# EasyEDA schematic Schematic.json
TITLE: Sheet_1; REV: 1.0; Date: 2025-10-23; Sheet: 1/1; Drawn By: leodu; Company: Your Company
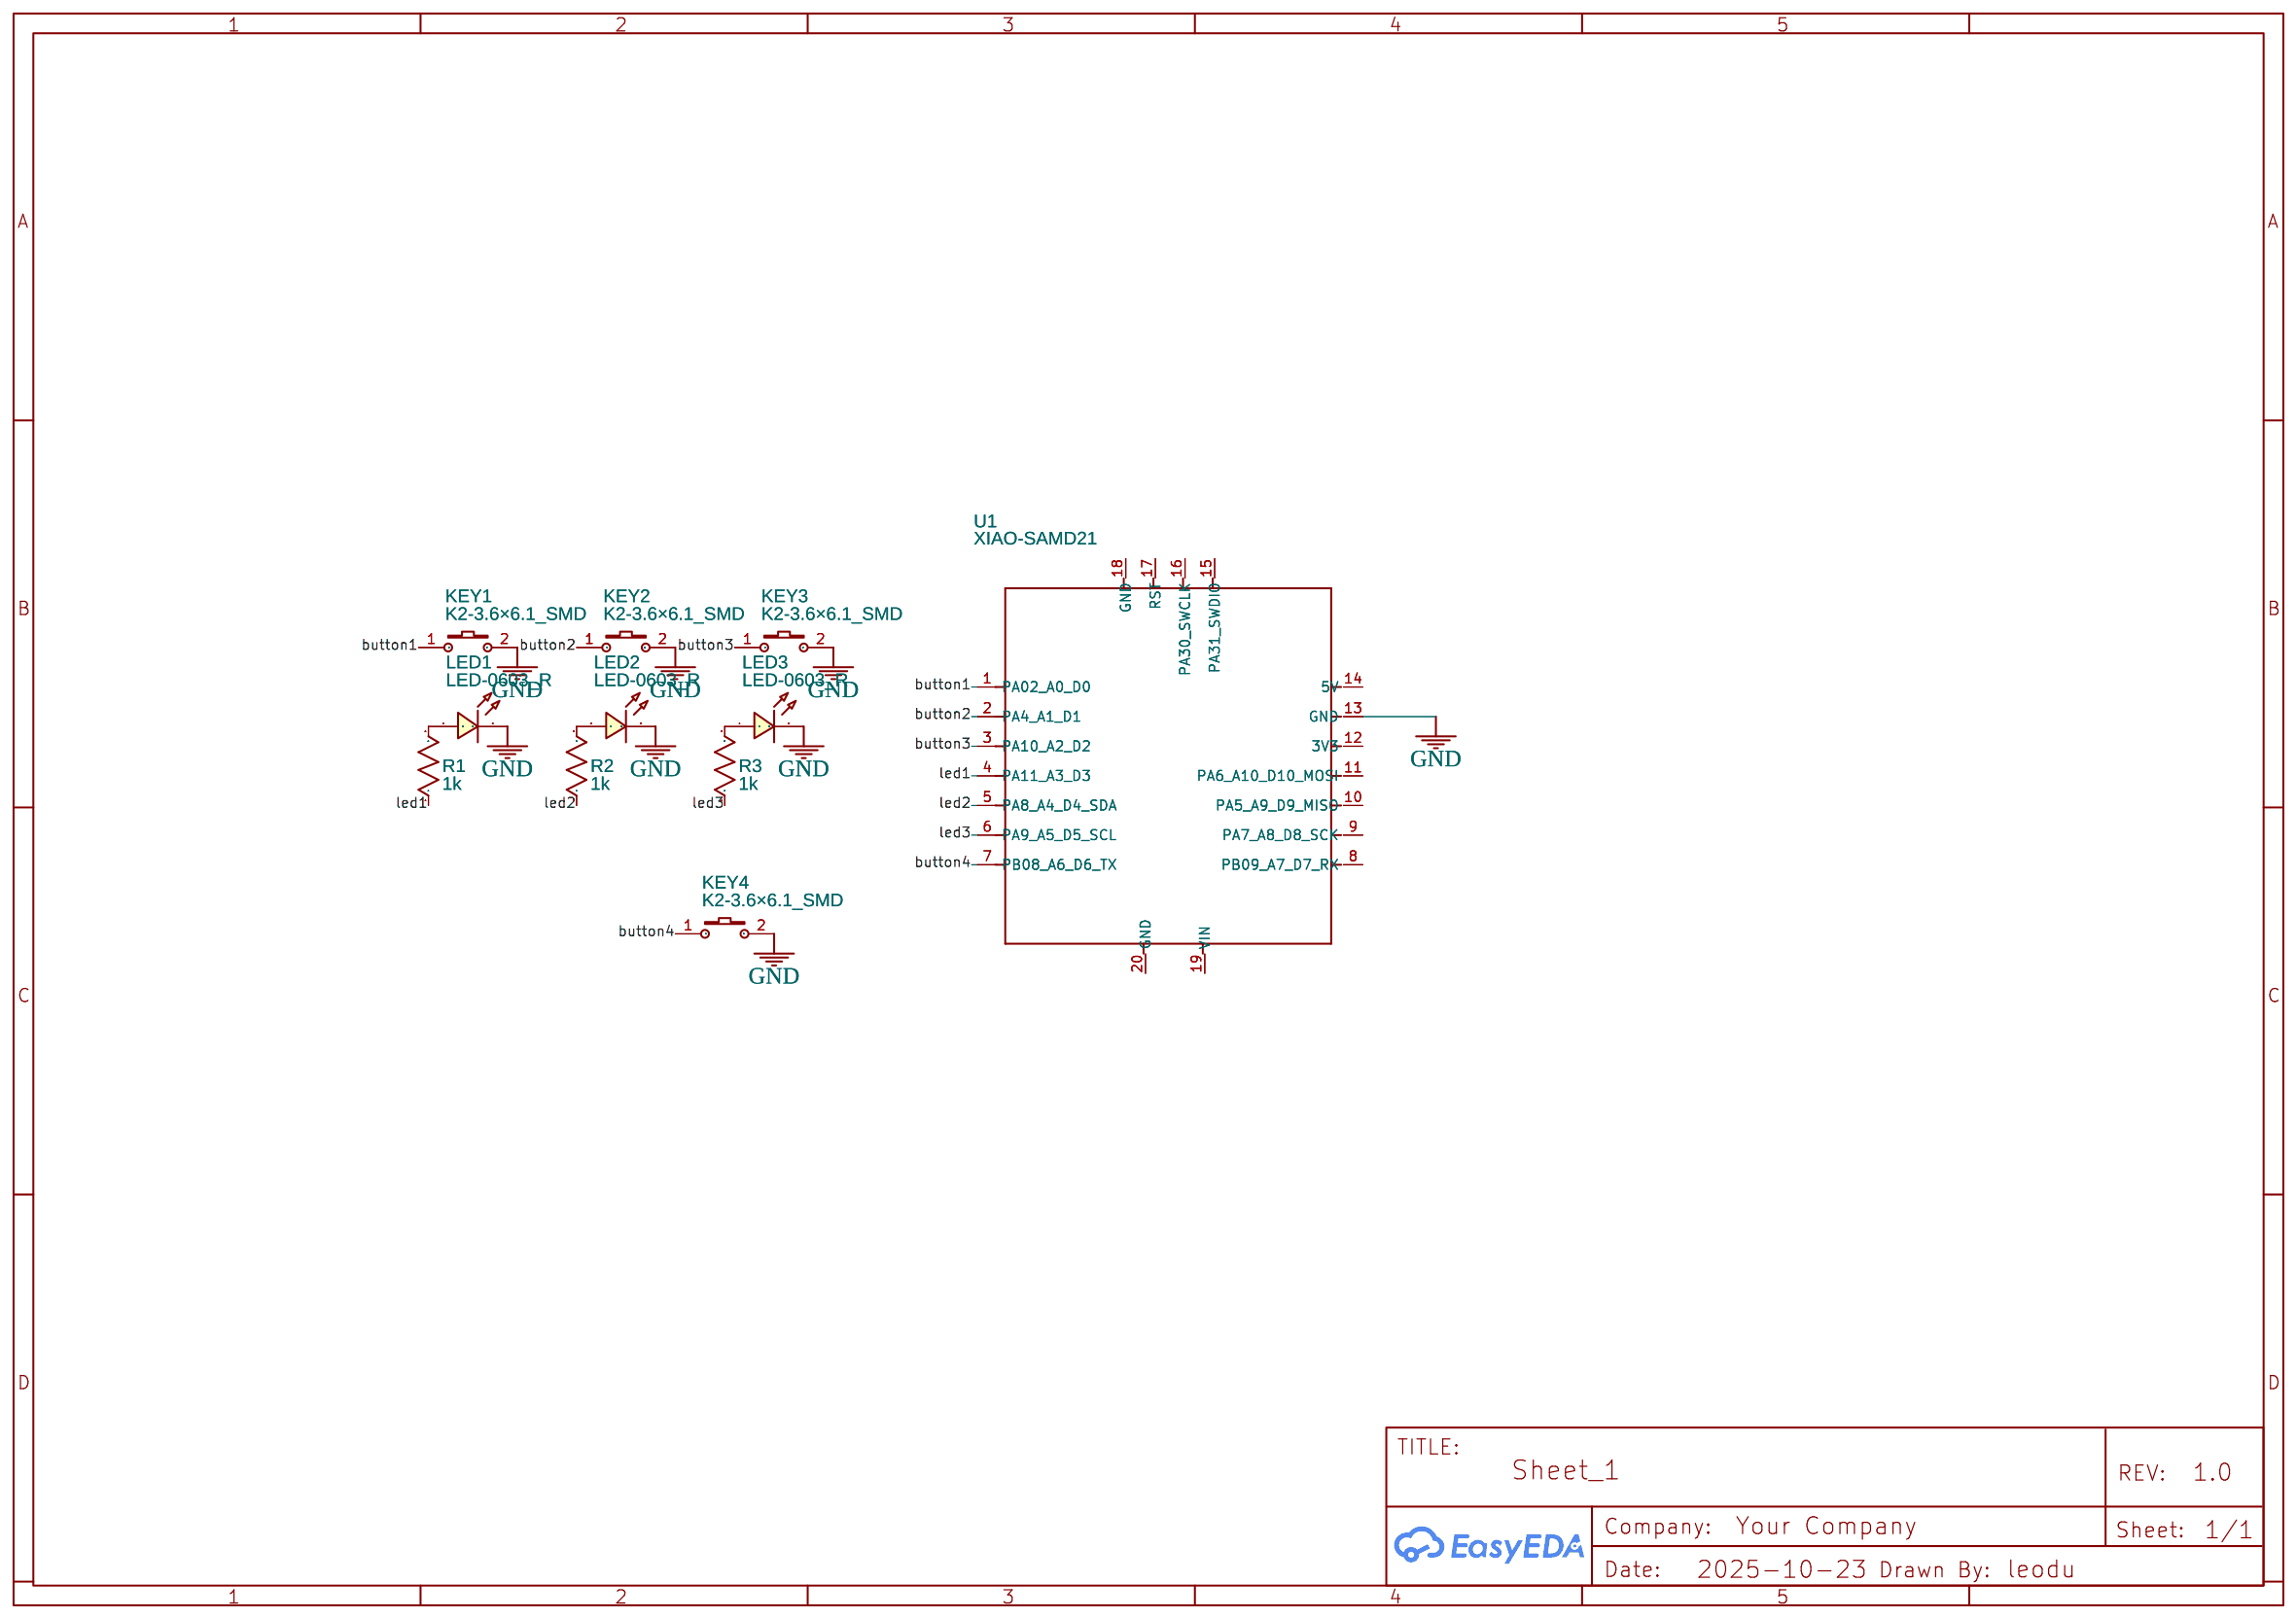
[diagram p0: schematic sheet]

## Parts
KEY1  K2-3.6×6.1_SMD  [KEY-SMD_2P-L6.2-W3.6-LS8.0]
KEY2  K2-3.6×6.1_SMD  [KEY-SMD_2P-L6.2-W3.6-LS8.0]
KEY3  K2-3.6×6.1_SMD  [KEY-SMD_2P-L6.2-W3.6-LS8.0]
KEY4  K2-3.6×6.1_SMD  [KEY-SMD_2P-L6.2-W3.6-LS8.0]
LED1  LED-0603_R  [LED0603_RED]
LED2  LED-0603_R  [LED0603_RED]
LED3  LED-0603_R  [LED0603_RED]
R1  1k  [R0603]
R2  1k  [R0603]
R3  1k  [R0603]
U1  XIAO-SAMD21  [XIAO-SAMD21/RP2040-MODULE14P-2.54-21X17.8MM]

## Library data of the parts
KEY1-KEY4 = K2-3.6×6.1_SMD: Supplier Part: C118141; Supplier: LCSC; Manufacturer Part: K2-1107ST-A4SW-06; Contributor: LCEDA_Lib; 制造商: 韩国韩荣
LED1-LED3 = LED-0603_R: Manufacturer: EVERLIGHT(台湾亿光); Manufacturer Part: 19-217/R6C-AL1M2VY/3T; Supplier Part: C72044; Supplier: LCSC; Contributor: LCEDA_01
R1-R3 = R_0603_US: Contributor: LCEDA_Lib
U1 = XIAO-SAMD21: Contributor: Jesusdparra

## Nets
GND: KEY1.2 KEY2.2 KEY3.2 KEY4.2 LED1.2 LED2.2 LED3.2 U1.13(GND)
button1: KEY1.1 U1.1(PA02_A0_D0)
button2: KEY2.1 U1.2(PA4_A1_D1)
button3: KEY3.1 U1.3(PA10_A2_D2)
button4: KEY4.1 U1.7(PB08_A6_D6_TX)
led1: R1.1 U1.4(PA11_A3_D3)
led2: R2.1 U1.5(PA8_A4_D4_SDA)
led3: R3.1 U1.6(PA9_A5_D5_SCL)
Net-(LED1-1): LED1.1 R1.2
Net-(LED2-1): LED2.1 R2.2
Net-(LED3-1): LED3.1 R3.2

Not connected (* = marked no-connect by the designer): U1 8(PB09_A7_D7_RX) 9(PA7_A8_D8_SCK) 10(PA5_A9_D9_MISO) 11(PA6_A10_D10_MOSI) 12(3V3) 14(5V) 15(PA31_SWDIO) 16(PA30_SWCLK) 17(RST) 18(GND) 19(VIN) 20(GND)
